# Altium schematic sheet CurrentMeter.SchDoc
size A3
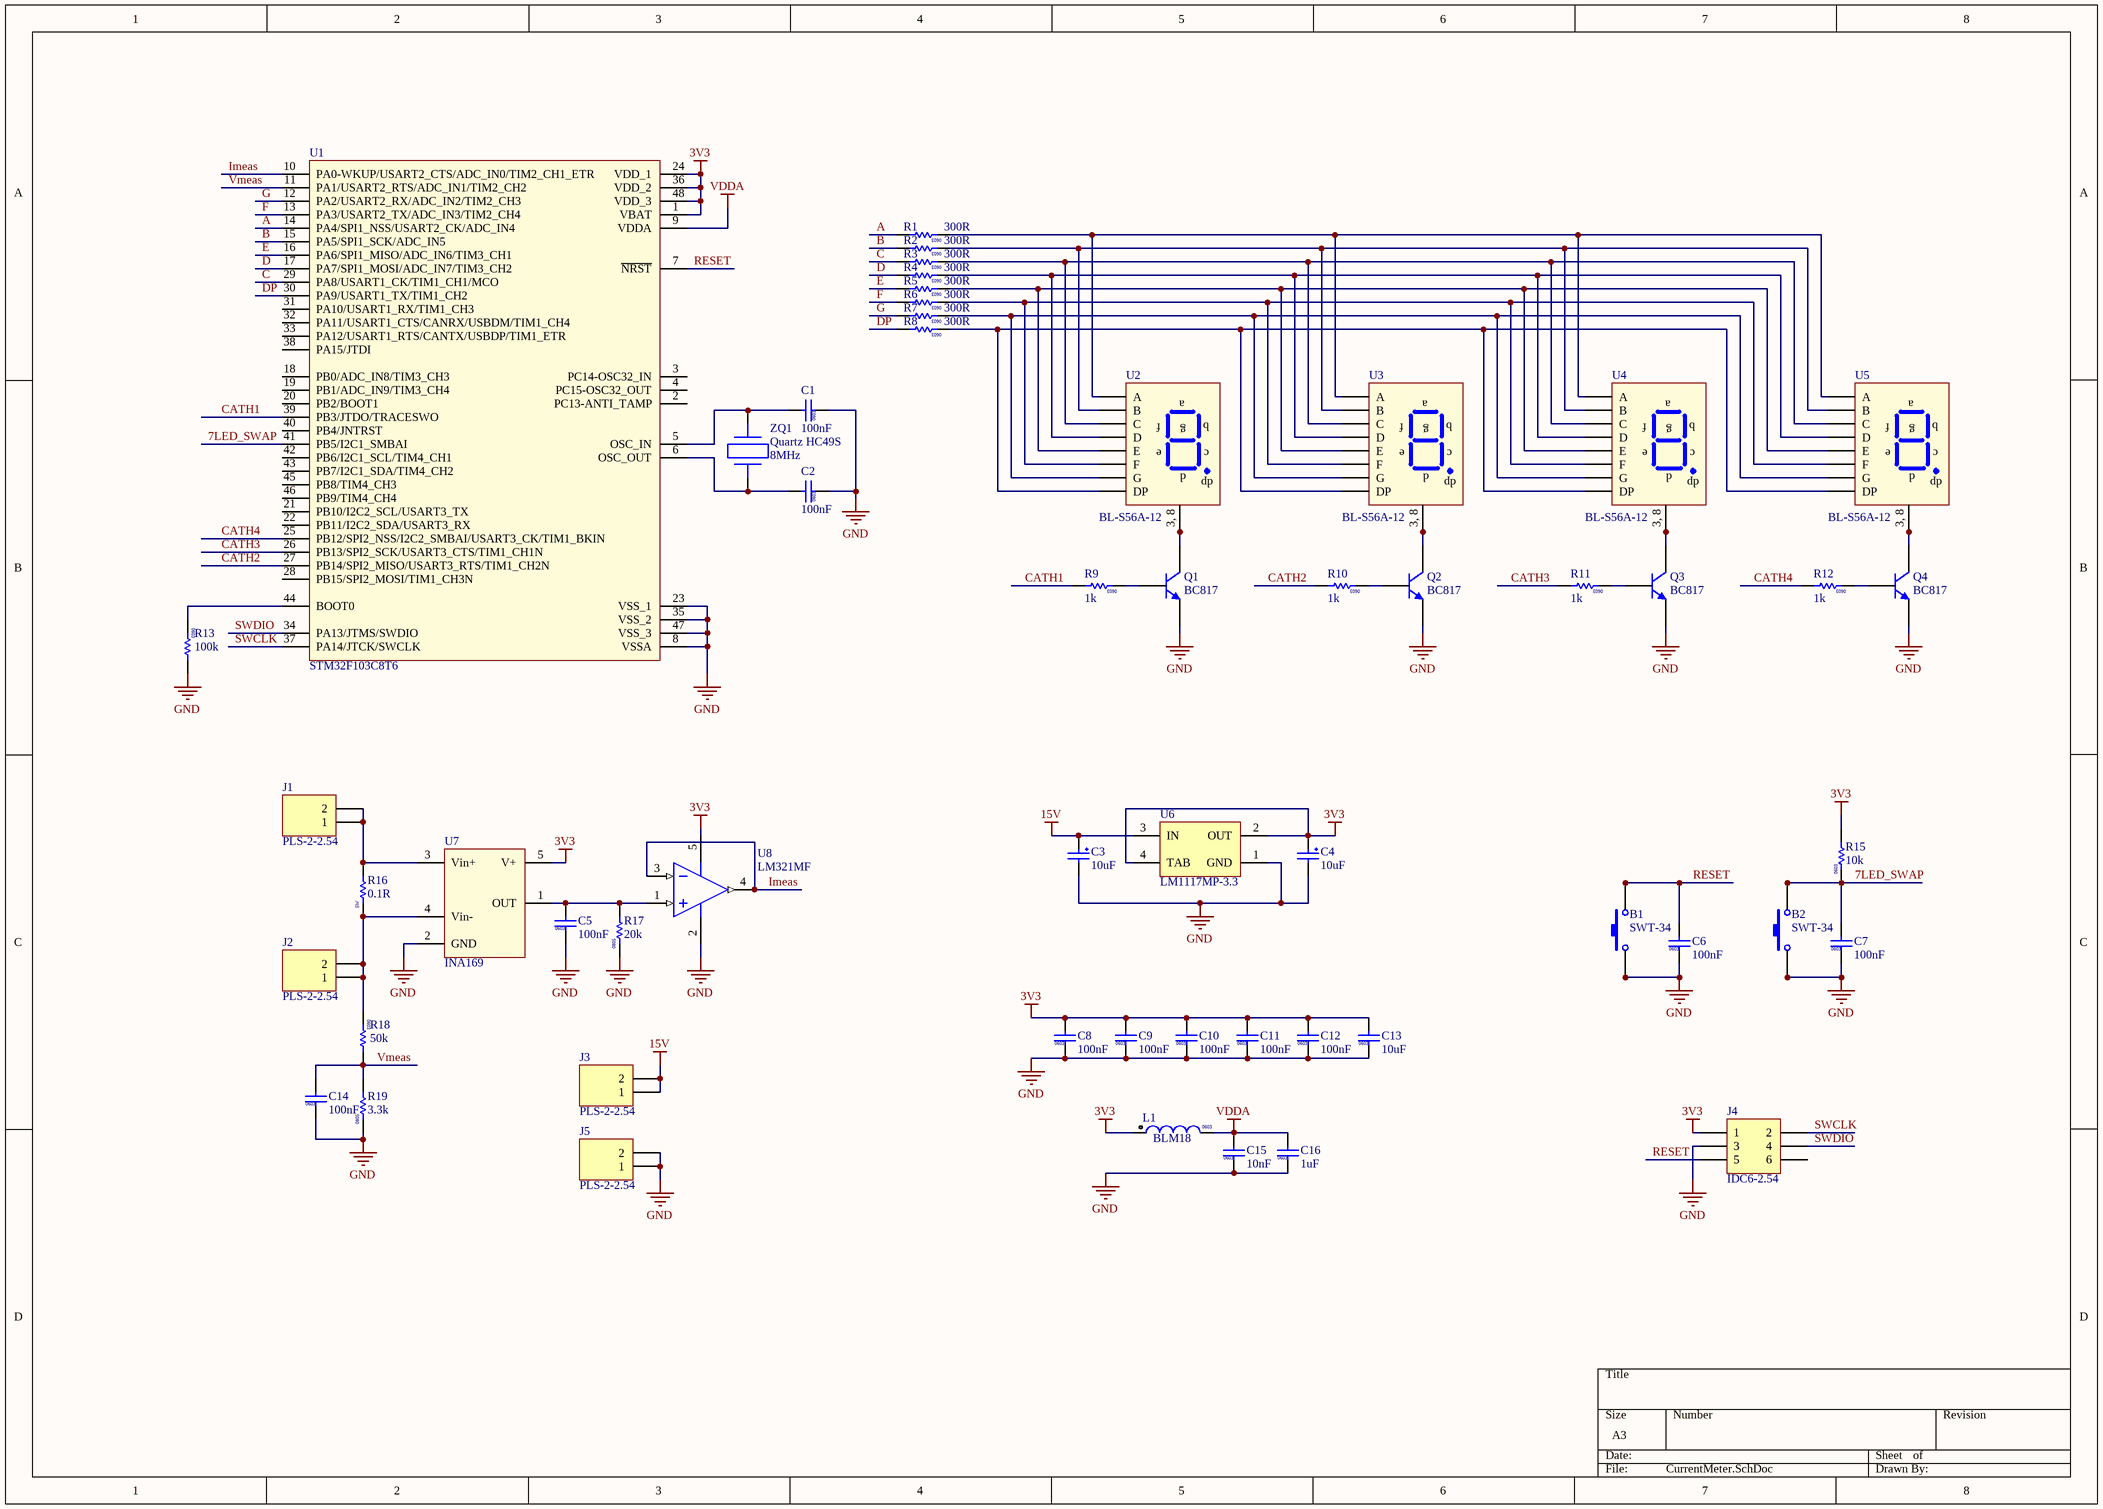
[diagram p0: CurrentMeter.SchDoc]

## Parts
B1  SWT-34  [SWT-34]
B2  SWT-34  [SWT-34]
C1  value 100nF  [CAPC1608-0603N]  (hidden comment: CAPC_0603)
C2  value 100nF  [CAPC1608-0603N]  (hidden comment: CAPC_0603)
C3  value 10uF  [TCAPC_A]  (hidden comment: TCAPC_A)
C4  value 10uF  [TCAPC_A]  (hidden comment: TCAPC_A)
C5  value 100nF  [CAPC1608-0603N]  (hidden comment: CAPC_0603)
C6  value 100nF  [CAPC1608-0603N]  (hidden comment: CAPC_0603)
C7  value 100nF  [CAPC1608-0603N]  (hidden comment: CAPC_0603)
C8  value 100nF  [CAPC1608-0603N]  (hidden comment: CAPC_0603)
C9  value 100nF  [CAPC1608-0603N]  (hidden comment: CAPC_0603)
C10  value 100nF  [CAPC1608-0603N]  (hidden comment: CAPC_0603)
C11  value 100nF  [CAPC1608-0603N]  (hidden comment: CAPC_0603)
C12  value 100nF  [CAPC1608-0603N]  (hidden comment: CAPC_0603)
C13  value 10uF  [CAPC1608-0603N]  (hidden comment: CAPC_0603)
C14  value 100nF  [CAPC1608-0603N]  (hidden comment: CAPC_0603)
C15  value 10nF  [CAPC1608-0603N]  (hidden comment: CAPC_0603)
C16  value 1uF  [CAPC1608-0603N]  (hidden comment: CAPC_0603)
J1  PLS-2-2.54  [PLS-2-2.54]
J2  PLS-2-2.54  [PLS-2-2.54]
J3  PLS-2-2.54  [PLS-2-2.54]
J4  IDC6-2.54  [IDC6-2.54]
J5  PLS-2-2.54  [PLS-2-2.54]
L1  value BLM18  [INDC1608AN]  (hidden comment: INDC-0603)
Q1  BC817  [SOT23-3N]
Q2  BC817  [SOT23-3N]
Q3  BC817  [SOT23-3N]
Q4  BC817  [SOT23-3N]
R1  value 300R  [RESC1608-0603N]  (hidden comment: RESC_0603)
R2  value 300R  [RESC1608-0603N]  (hidden comment: RESC_0603)
R3  value 300R  [RESC1608-0603N]  (hidden comment: RESC_0603)
R4  value 300R  [RESC1608-0603N]  (hidden comment: RESC_0603)
R5  value 300R  [RESC1608-0603N]  (hidden comment: RESC_0603)
R6  value 300R  [RESC1608-0603N]  (hidden comment: RESC_0603)
R7  value 300R  [RESC1608-0603N]  (hidden comment: RESC_0603)
R8  value 300R  [RESC1608-0603N]  (hidden comment: RESC_0603)
R9  value 1k  [RESC1608-0603N]  (hidden comment: RESC_0603)
R10  value 1k  [RESC1608-0603N]  (hidden comment: RESC_0603)
R11  value 1k  [RESC1608-0603N]  (hidden comment: RESC_0603)
R12  value 1k  [RESC1608-0603N]  (hidden comment: RESC_0603)
R13  value 100k  [RESC1608-0603M]  (hidden comment: RESC_0603)
R15  value 10k  [RESC1608-0603N]  (hidden comment: RESC_0603)
R16  value 0.1R  [RES5W]  (hidden comment: RES_5W)
R17  value 20k  [RESC2012-0805N]  (hidden comment: RESC_0805)
R18  value 50k  [RESC1608-0603N]  (hidden comment: RESC_0603)
R19  value 3.3k  [RESC2012-0805N]  (hidden comment: RESC_0805)
U1  STM32F103C8T6  [QFP48_L]
U2  BL-S56A-12  [BL-S56A-12]
U3  BL-S56A-12  [BL-S56A-12]
U4  BL-S56A-12  [BL-S56A-12]
U5  BL-S56A-12  [BL-S56A-12]
U6  LM1117MP-3.3  [MP04A_N]
U7  INA169  [INA169_N]
U8  LM321MF  [MF05A_N]
ZQ1  Quartz HC49S  value 8MHz  [HC-49S]

## Nets
3V3: C4.1 C8.2 C9.2 C10.2 C11.2 C12.2 C13.2 J4.1 L1.1 R15.2 U1.1(VBAT) U1.24(VDD_1) U1.36(VDD_2) U1.48(VDD_3) U6.2(OUT) U6.4(TAB) U7.5(V+) U8.5(V+)
15V: C3.1 J3.1 J3.2 U6.3(IN)
GND: B1.1 B1.2 B2.1 B2.2 C1.1 C2.1 C3.2 C4.2 C5.1 C6.1 C7.1 C8.1 C9.1 C10.1 C11.1 C12.1 C13.1 C14.1 C15.1 C16.1 J4.3 J5.1 J5.2 Q1.2(E) Q2.2(E) Q3.2(E) Q4.2(E) R13.2 R17.1 R19.1 U1.8(VSSA) U1.23(VSS_1) U1.35(VSS_2) U1.47(VSS_3) U6.1(GND) U7.2(GND) U8.2(V-)
VDDA: C15.2 C16.2 L1.2 U1.9(VDDA)
7LED_SWAP: B2.3 B2.4 C7.2 R15.1 U1.41(PB5/I2C1_SMBAI)
A: R1.2 U1.14(PA4/SPI1_NSS/USART2_CK/ADC_IN4)
B: R2.2 U1.15(PA5/SPI1_SCK/ADC_IN5)
C: R3.2 U1.29(PA8/USART1_CK/TIM1_CH1/MCO)
CATH1: R9.2 U1.39(PB3/JTDO/TRACESWO)
CATH2: R10.2 U1.27(PB14/SPI2_MISO/USART3_RTS/TIM1_CH2N)
CATH3: R11.2 U1.26(PB13/SPI2_SCK/USART3_CTS/TIM1_CH1N)
CATH4: R12.2 U1.25(PB12/SPI2_NSS/I2C2_SMBAI/USART3_CK/TIM1_BKIN)
D: R4.2 U1.17(PA7/SPI1_MOSI/ADC_IN7/TIM3_CH2)
DP: R8.2 U1.30(PA9/USART1_TX/TIM1_CH2)
E: R5.2 U1.16(PA6/SPI1_MISO/ADC_IN6/TIM3_CH1)
F: R6.2 U1.13(PA3/USART2_TX/ADC_IN3/TIM2_CH4)
G: R7.2 U1.12(PA2/USART2_RX/ADC_IN2/TIM2_CH3)
Imeas: U1.10(PA0-WKUP/USART2_CTS/ADC_IN0/TIM2_CH1_ETR) U8.3(IN-) U8.4(OUT)
RESET: B1.3 B1.4 C6.2 J4.5 U1.7(~{NRST})
SWCLK: J4.2 U1.37(PA14/JTCK/SWCLK)
SWDIO: J4.4 U1.34(PA13/JTMS/SWDIO)
Vmeas: C14.2 R18.2 R19.2 U1.11(PA1/USART2_RTS/ADC_IN1/TIM2_CH2)
NetC1_2: C1.2 U1.5(OSC_IN) ZQ1.2
NetC2_2: C2.2 U1.6(OSC_OUT) ZQ1.1
NetC5_2: C5.2 R17.2 U7.1(OUT) U8.1(IN+)
NetJ1_1: J1.1 J1.2 R16.2 U7.3(Vin+)
NetJ2_1: J2.1 J2.2 R16.1 R18.1 U7.4(Vin-)
NetQ1_1: Q1.1(B) R9.1
NetQ1_3: Q1.3(C) U2.3(CATHODE) U2.8(CATHODE)
NetQ2_1: Q2.1(B) R10.1
NetQ2_3: Q2.3(C) U3.3(CATHODE) U3.8(CATHODE)
NetQ3_1: Q3.1(B) R11.1
NetQ3_3: Q3.3(C) U4.3(CATHODE) U4.8(CATHODE)
NetQ4_1: Q4.1(B) R12.1
NetQ4_3: Q4.3(C) U5.3(CATHODE) U5.8(CATHODE)
NetR1_1: R1.1 U2.7(A) U3.7(A) U4.7(A) U5.7(A)
NetR2_1: R2.1 U2.6(B) U3.6(B) U4.6(B) U5.6(B)
NetR3_1: R3.1 U2.4(C) U3.4(C) U4.4(C) U5.4(C)
NetR4_1: R4.1 U2.2(D) U3.2(D) U4.2(D) U5.2(D)
NetR5_1: R5.1 U2.1(E) U3.1(E) U4.1(E) U5.1(E)
NetR6_1: R6.1 U2.9(F) U3.9(F) U4.9(F) U5.9(F)
NetR7_1: R7.1 U2.10(G) U3.10(G) U4.10(G) U5.10(G)
NetR8_1: R8.1 U2.5(DP) U3.5(DP) U4.5(DP) U5.5(DP)
NetR13_1: R13.1 U1.44(BOOT0)

Not connected (* = marked no-connect by the designer): J4 6; U1 2(PC13-ANTI_TAMP) 3(PC14-OSC32_IN) 4(PC15-OSC32_OUT) 18(PB0/ADC_IN8/TIM3_CH3) 19(PB1/ADC_IN9/TIM3_CH4) 20(PB2/BOOT1) 21(PB10/I2C2_SCL/USART3_TX) 22(PB11/I2C2_SDA/USART3_RX) 28(PB15/SPI2_MOSI/TIM1_CH3N) 31(PA10/USART1_RX/TIM1_CH3) 32(PA11/USART1_CTS/CANRX/USBDM/TIM1_CH4) 33(PA12/USART1_RTS/CANTX/USBDP/TIM1_ETR) 38(PA15/JTDI) 40(PB4/JNTRST) 42(PB6/I2C1_SCL/TIM4_CH1) 43(PB7/I2C1_SDA/TIM4_CH2) 45(PB8/TIM4_CH3) 46(PB9/TIM4_CH4)

## Notes on the sheet
- (in symbol BL-S56A-12) a; f; b; g; e; c; d; dp; 3, 8
- (in symbol CAPC_0603) 0603
- (in symbol INDC-0603) 0603
- (in symbol RES_5W) 5W
- (in symbol RESC_0603) 0603
- (in symbol RESC_0805) 0805

## Library data of the parts
B1 B2 = SWT-34: KLS7-TS6604-7.0-180-T, SMD Button h=7mm
C1 C2 C5-C16 = CAPC_0603: Capacitor 0603
C3 C4 = TCAPC_A: Capacitor tantalum SMD type A
J4 = IDC6-2.54: IDC6 2.54 mm pitch Straight, plastic Box
L1 = INDC-0603: Chip Inductor, Body Body 1.6x0.8mm
Q1-Q4 = BC817: BC817 NPN Transistor
R1-R13 R15 R18 = RESC_0603: Resistor 0603
R16 = RES_5W: Resistor 5W
R17 R19 = RESC_0805: Resistor 0805
U1 = STM32F103C8T6: ARM 32-bit MCU with Flash, USB, CAN, seven 16-bit timers, two ADCs and nine communication interfaces
U2-U5 = BL-S56A-12: LED Numeric Display, 1 Digit
U6 = LM1117MP-3.3: 800mA Low-Dropout Linear Regulator; Manufacturer: National Semiconductor; CompType: LDO IC; PackageTopMarking: XYTT*N05A; PowerWise: N; Published: 4-Dec-2008; DatasheetVersion: Apr-2006; PackageVersion: revB, Apr-2003; PackageReference: MP04A; Publisher: Altium Limited; PackageDescription: Molded SOT-223, 6.50 x 3.56 x 1.6mm Body, 4 Lead, 2.3mm Pitch; PartNumber: LM1117MP-3.3; RoHS: O; PinCount: 4; DigiKeyPartNumber: LM1117MP-3.3CT-ND; Code_JEDEC: TO-261-AA; Code_IPC: SOT223-4; ComponentLink1Description: LM1117 Datasheet; ComponentLink1URL: http://www.national.com/ds/LM/LM1117.pdf; ComponentLink2Description: LM1117 Web Page; ComponentLink2URL: http://www.national.com/pf/LM/LM1117.html; ComponentLink3Description: MP04A Package Page; ComponentLink3URL: http://www.national.com/packaging/folders/mp04a.html
U7 = INA169: High-side Current Shunt Monitor
U8 = LM321MF: Low Power Single Op Amp; Manufacturer: National Semiconductor; CompType: Amplifiers; PackageTopMarking: A63A*XTT; PowerWise: N; Published: 4-Dec-2008; LatestRevisionDate: 13-Jan-2009; LatestRevisionNote: Sim Model Added.; DatasheetVersion: Apr-2001; PackageVersion: revD, Aug-2008; PackageReference: MF05A; Publisher: Altium Limited; PackageDescription: Molded SOT-23, .115 x .063 x .040 in Body, 5 Lead, .0375 in Pitch; PartNumber: LM321MF; RoHS: O; PinCount: 5; DigiKeyPartNumber: LM321MFCT-ND; Code_IPC: SOT23-5; ComponentLink1Description: LM321 Datasheet; ComponentLink1URL: http://www.national.com/ds/LM/LM321.pdf; ComponentLink2Description: LM321 Web Page; ComponentLink2URL: http://www.national.com/pf/LM/LM321.html; ComponentLink3Description: MF05A Package Page; ComponentLink3URL: http://www.national.com/packaging/folders/mf05a.html
J1-J3 J5 = PLS-2-2.54: LatestRevisionDate: 17-Jul-2002; LatestRevisionNote: Re-released for DXP Platform.; Publisher: Altium Limited